# Altium schematic sheet 51control.SchDoc
size A2
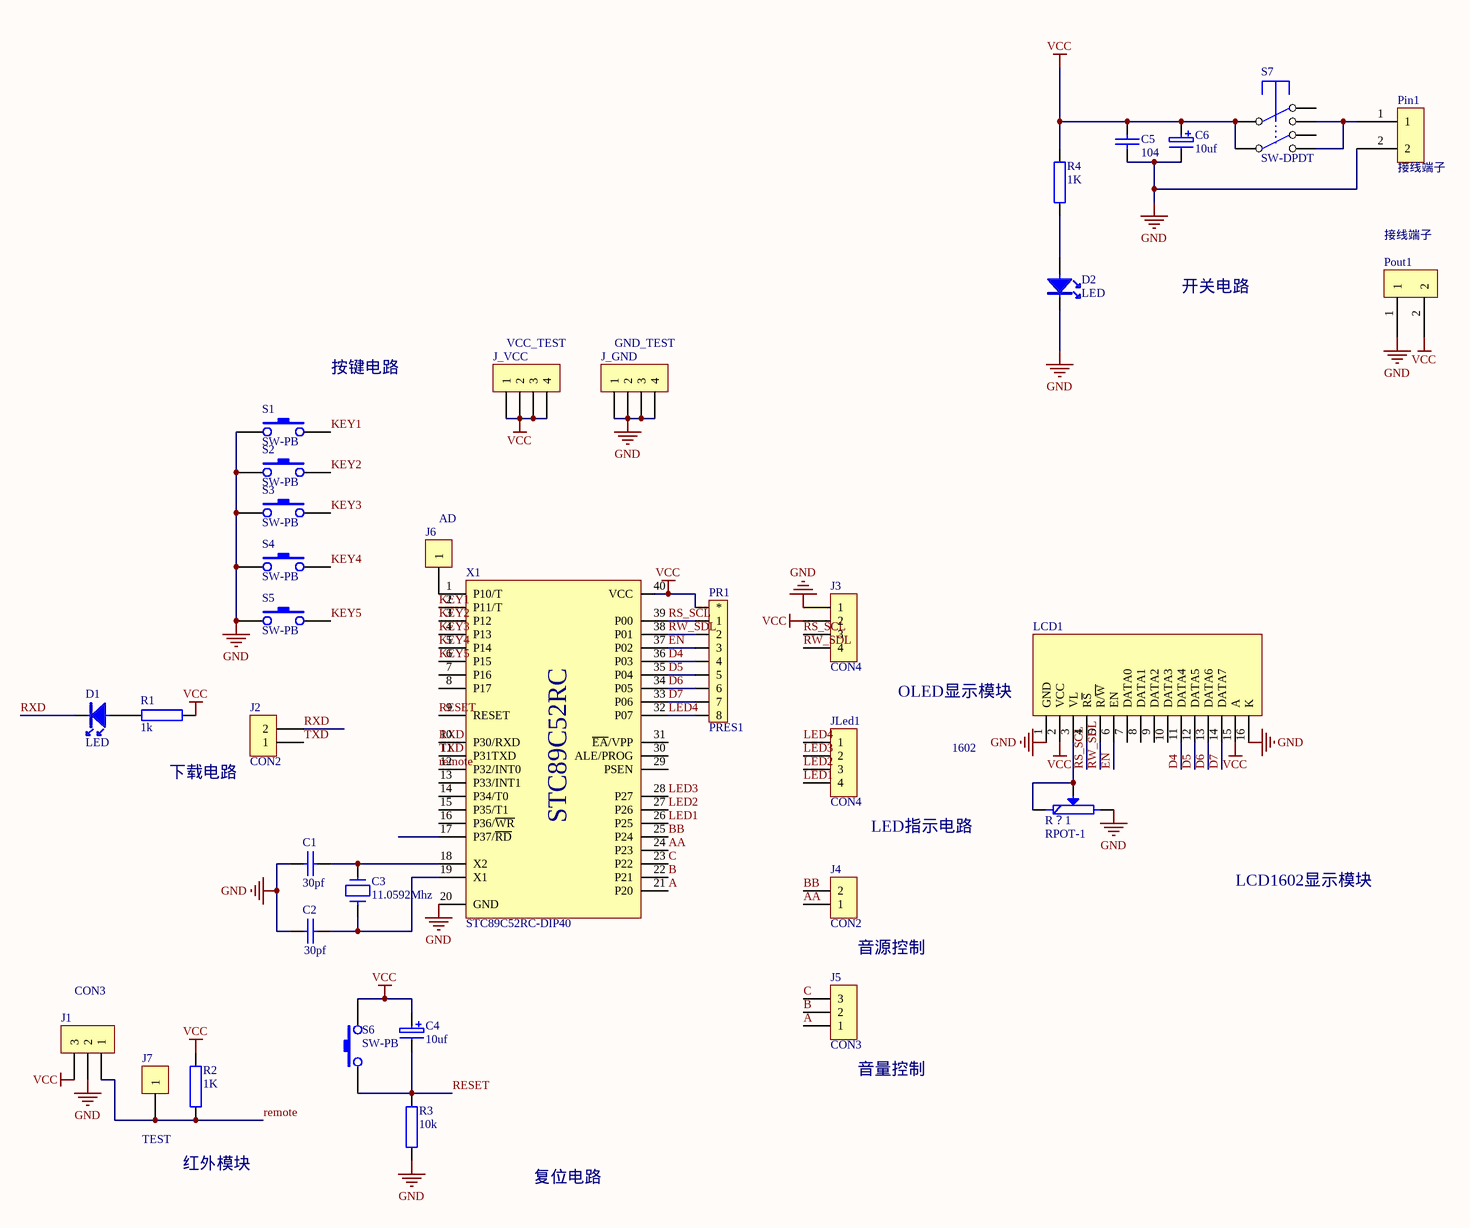
[diagram p0: 51control.SchDoc]

## Parts
C1  30pf  [CAP2]
C2  30pf  [CAP2]
C3  11.0592Mhz  [XTAL1]
C4  10uf  [CAO1]
C5  104  [CAP2]
C6  10uf  [CAO2]
D1  LED  [LED2_B]
D2  LED  [LED2_B]
J1  CON3  [sip-3]
J2  CON2  [sip-2]
J3  CON4  [sip-4]
J4  CON2  [sip-2]
J5  CON3  [sip-3]
J6  AD  [SIP-1]
J7  TEST  [SIP-1]
J_GND  GND_TEST  [sip-4]
J_VCC  VCC_TEST  [sip-4]
JLed1  CON4  [sip-4]
LCD1  1602  [1602]
Pin1  接线端子  [接线端子]
Pout1  接线端子  [接线端子]
PR1  PRES1  [RP1]
R1  1k  [AXIAL0.5]
R2  1K  [AXIAL0.5]
R3  10k  [AXIAL0.5]
R4  1K  [AXIAL0.5]
R？1  RPOT-1  [RVR-2]
S1  SW-PB  [SW6*6]
S2  SW-PB  [SW6*6]
S3  SW-PB  [SW6*6]
S4  SW-PB  [SW6*6]
S5  SW-PB  [SW6*6]
S6  SW-PB  [SW6*6]
S7  SW-DPDT  [SWH8*8]
X1  STC89C52RC-DIP40  [DIP-40SJ]

## Nets
GND: C1.2 C2.2 C5.2 C6.2 D2.2 J1.2 J3.1 J_GND.1 J_GND.2 J_GND.3 J_GND.4 LCD1.1(GND) LCD1.16(K) Pin1.2 Pout1.1 R3.1 R？1.3 S1.1 S2.1 S3.1 S4.1 S5.1 X1.20(GND)
VCC: C4.1 C5.1 C6.1 J1.3 J3.2 J_VCC.1 J_VCC.2 J_VCC.3 J_VCC.4 LCD1.2(VCC) LCD1.15(A) Pout1.2 PR1.1 R1.1 R2.2 R4.2 S6.2 S7.2 S7.5 X1.40(VCC)
A: J5.1 X1.21(P20)
AA: J4.1 X1.24(P23)
B: J5.2 X1.22(P21)
BB: J4.2 X1.25(P24)
C: J5.3 X1.23(P22)
D4: LCD1.11(DATA4) PR1.5(4) X1.36(P03)
D5: LCD1.12(DATA5) PR1.6(5) X1.35(P04)
D6: LCD1.13(DATA6) PR1.7(6) X1.34(P05)
D7: LCD1.14(DATA7) PR1.8(7) X1.33(P06)
EN: LCD1.6(EN) PR1.4(3) X1.37(P02)
KEY1: S1.2 X1.2(P11/T)
KEY2: S2.2 X1.3(P12)
KEY3: S3.2 X1.4(P13)
KEY4: S4.2 X1.5(P14)
KEY5: S5.2 X1.6(P15)
LED1: JLed1.4 X1.26(P25)
LED2: JLed1.3 X1.27(P26)
LED3: JLed1.2 X1.28(P27)
LED4: JLed1.1 PR1.9(8) X1.32(P07)
remote: J1.1 J7.1 R2.1 X1.12(P32/INT0)
RESET: C4.2 R3.2 S6.1 X1.9(RESET)
RS_SCL: J3.3 LCD1.4(R~{S}) PR1.2(1) X1.39(P00)
RW_SDL: J3.4 LCD1.5(R/~{W}) PR1.3(2) X1.38(P01)
RXD: D1.2 J2.2 X1.10(P30/RXD)
TXD: J2.1 X1.11(P31TXD)
NetC1_1: C1.1 C3.2 X1.18(X2)
NetC2_1: C2.1 C3.1 X1.19(X1)
NetD1_1: D1.1 R1.2
NetD2_1: D2.1 R4.1
NetJ6_1: J6.1 X1.1(P10/T)
NetLCD1_3: LCD1.3(VL) R？1.1 R？1.2(M)
NetPin1_1: Pin1.1 S7.3 S7.4

Not connected (* = marked no-connect by the designer): LCD1 7(DATA0) 8(DATA1) 9(DATA2) 10(DATA3); S7 1 6; X1 7(P16) 8(P17) 13(P33/INT1) 14(P34/T0) 15(P35/T1) 16(P36/~{WR}) 17(P37/~{RD}) 29(PSEN) 30(ALE/PROG) 31(~{EA}/VPP)

## Notes on the sheet
- 开关电路
- 按键电路
- OLED显示模块
- 下载电路
- LED指示电路
- LCD1602显示模块
- 音源控制
- (near J5) 音量控制
- 红外模块
- 复位电路
- (in symbol STC89C52RC-DIP40) STC89C52RC

## Library data of the parts
C1 C2 C5 = CAP1
C3 = CPY
C4 C6 = CAP3
J1 J5 = CON3: Connector
J2 J4 = CON2: Connector
J3 J_GND J_VCC JLed1 = CON4: Connector
J6 J7 = CON1: Connector
R1-R4 = RES: 电阻
R？1 = RPOT-1: 普通电位器